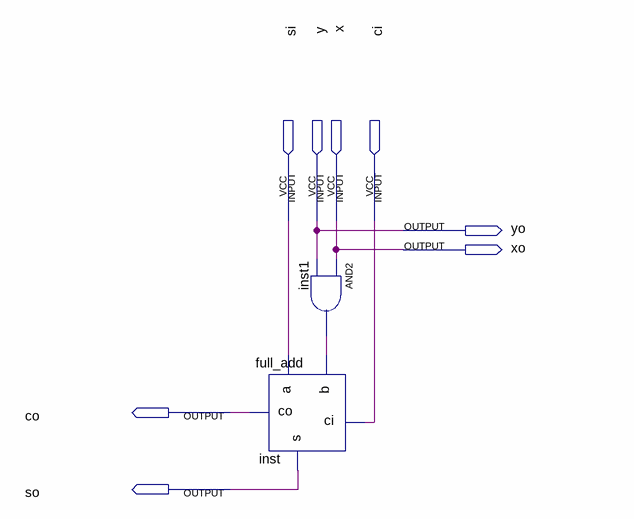
[diagram p0: schematic sheet]
// Quartus schematic unit_mult.bdf as structural Verilog: 2 symbols, 8 pins
module unit_mult (
  input  si,
  input  y,
  input  x,
  input  ci,
  output yo,
  output xo,
  output co,
  output so
);

  wire inst1_out;

  full_add inst (.a(si), .b(inst1_out), .ci(ci), .co(co), .s(so));
  and inst1 (inst1_out, x, y);

  assign xo = x;
  assign yo = y;
endmodule
